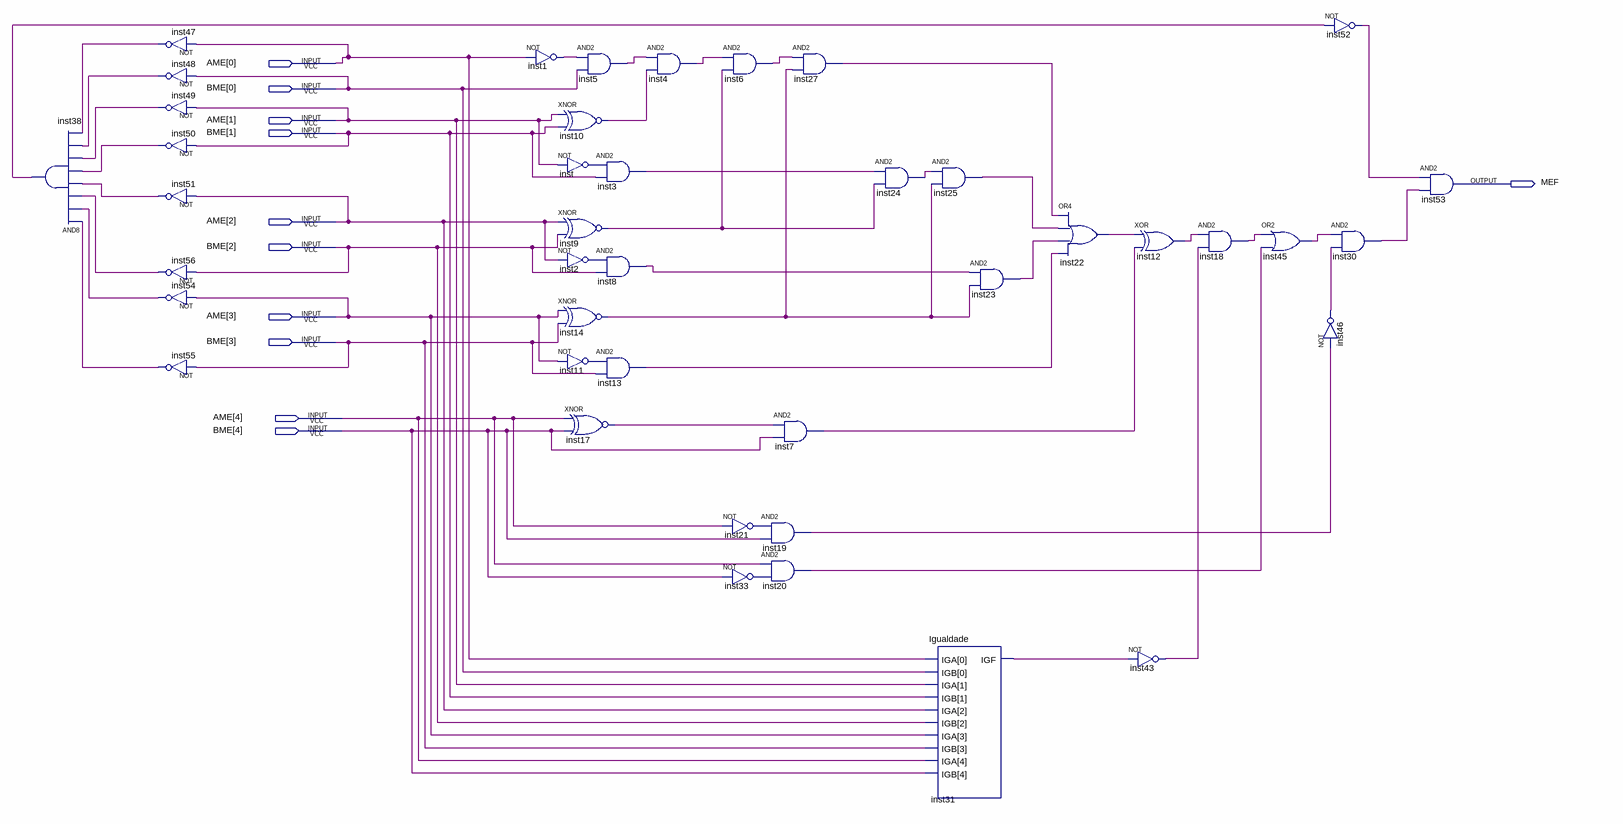
[diagram p0: schematic sheet]
// Quartus schematic AmenorB.bdf as structural Verilog: 42 symbols, 11 pins
module AmenorB (
  input  [4:0] AME,
  input  [4:0] BME,
  output MEF
);

  wire inst1_out, inst2_out, inst3_out, inst4_out, inst5_out, inst6_out, inst7_out, inst8_out, inst9_out,
       inst10_out, inst11_out, inst12_out, inst13_out, inst14_out, inst17_out, inst18_out, inst19_out,
       inst20_out, inst21_out, inst22_out, inst23_out, inst24_out, inst25_out, inst27_out, inst30_out,
       inst31_igf, inst33_out, inst38_out, inst43_out, inst45_out, inst46_out, inst47_out, inst48_out,
       inst49_out, inst50_out, inst51_out, inst52_out, inst54_out, inst55_out, inst56_out, inst_out;

  and inst38 (inst38_out, inst55_out, inst54_out, inst56_out, inst51_out, inst50_out, inst49_out, inst48_out, inst47_out);
  not inst47 (inst47_out, AME[0]);
  not inst48 (inst48_out, BME[0]);
  not inst49 (inst49_out, AME[1]);
  not inst50 (inst50_out, BME[1]);
  not inst51 (inst51_out, AME[2]);
  not inst56 (inst56_out, BME[2]);
  not inst54 (inst54_out, AME[3]);
  not inst55 (inst55_out, BME[3]);
  not inst1 (inst1_out, AME[0]);
  and inst5 (inst5_out, inst1_out, BME[0]);
  xnor inst10 (inst10_out, AME[1], BME[1]);
  not inst (inst_out, AME[1]);
  and inst3 (inst3_out, inst_out, BME[1]);
  xnor inst9 (inst9_out, AME[2], BME[2]);
  not inst2 (inst2_out, AME[2]);
  and inst8 (inst8_out, inst2_out, BME[2]);
  xnor inst14 (inst14_out, AME[3], BME[3]);
  not inst11 (inst11_out, AME[3]);
  and inst13 (inst13_out, inst11_out, BME[3]);
  xnor inst17 (inst17_out, AME[4], BME[4]);
  and inst4 (inst4_out, inst5_out, inst10_out);
  and inst6 (inst6_out, inst4_out, inst9_out);
  not inst21 (inst21_out, AME[4]);
  not inst33 (inst33_out, BME[4]);
  and inst27 (inst27_out, inst6_out, inst14_out);
  and inst7 (inst7_out, inst17_out, BME[4]);
  and inst19 (inst19_out, inst21_out, BME[4]);
  and inst20 (inst20_out, AME[4], inst33_out);
  and inst24 (inst24_out, inst3_out, inst9_out);
  and inst25 (inst25_out, inst24_out, inst14_out);
  Igualdade inst31 (.IGA(AME), .IGB(BME), .IGF(inst31_igf));
  and inst23 (inst23_out, inst8_out, inst14_out);
  or inst22 (inst22_out, inst27_out, inst25_out, inst23_out, inst13_out);
  xor inst12 (inst12_out, inst22_out, inst7_out);
  not inst43 (inst43_out, inst31_igf);
  and inst18 (inst18_out, inst12_out, inst43_out);
  or inst45 (inst45_out, inst18_out, inst20_out);
  not inst52 (inst52_out, inst38_out);
  and inst30 (inst30_out, inst45_out, inst46_out);
  not inst46 (inst46_out, inst19_out);
  and inst53 (MEF, inst52_out, inst30_out);
endmodule
